# EAGLE design wificontrolpanel (EAGLE 8.2.1)
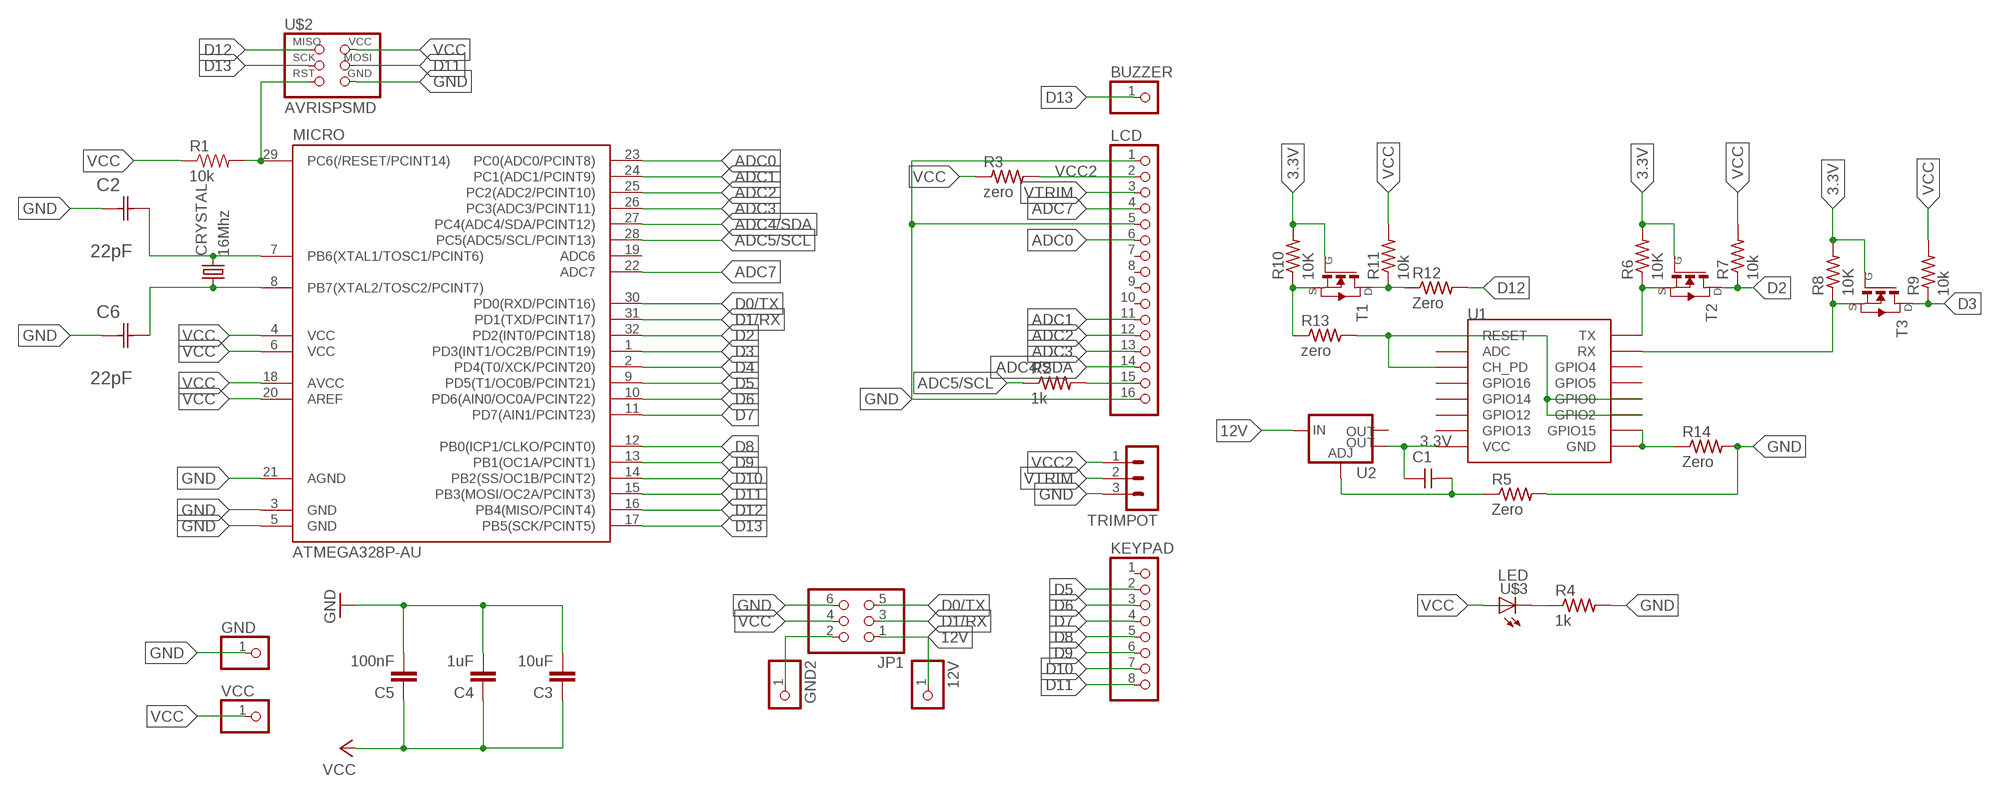
[diagram p0: schematic, sheet 1]

## Parts
12V  PINHD-1X1  [1X01]
BUZZER  PINHD-1X1  [1X01]
C1  CAP-UNPOLARIZEDFAB  [C1206FAB]
C2  22pF  0612ZC225MAT2A  [CAPC3216X178N]
C3  10uF  CAP1206  [1206]
C4  1uF  CAP1206  [1206]
C5  100nF  CAP1206  [1206]
C6  22pF  0612ZC225MAT2A  [CAPC3216X178N]
CRYSTAL  16Mhz  CSM-7X-DU  [CSM-7X-DU]
GND  PINHD-1X1  [1X01]
GND2  PINHD-1X1  [1X01]
JP1  PINHD-2X3-SMD  [2X03SMD]
KEYPAD  PINHD-1X8  [1X08]
LCD  PINHD-1X16  [1X16]
MICRO  ATMEGA328P-AU  ATMEGA48/88/168-AU  [TQFP32-08]
R1  10k  RESISTOR1206  [1206]
R2  1k  RES-US1206FAB  [R1206FAB]
R3  zero  RES-US1206FAB  [R1206FAB]
R4  1k  RES-US1206  [R1206]
R5  Zero  RES-US1206FAB  [R1206FAB]
R6  10K  RES-US1206FAB  [R1206FAB]
R7  10k  RES-US1206FAB  [R1206FAB]
R8  10K  RES-US1206FAB  [R1206FAB]
R9  10k  RES-US1206FAB  [R1206FAB]
R10  10K  RES-US1206FAB  [R1206FAB]
R11  10k  RES-US1206FAB  [R1206FAB]
R12  Zero  RES-US1206FAB  [R1206FAB]
R13  zero  RES-US1206FAB  [R1206FAB]
R14  Zero  RES-US1206FAB  [R1206FAB]
T1  NMOSFETSOT23  [SOT-23]
T2  NMOSFETSOT23  [SOT-23]
T3  NMOSFETSOT23  [SOT-23]
TRIMPOT  MA03-1  [MA03-1]
U1  ESP12SMD  [ESP12-SMD]
U2  V_REG_LM1117SOT223  [SOT223]
U$2  AVRISPSMD  [2X03SMD]
U$3  LED  [LED1206]
VCC  PINHD-1X1  [1X01]

## Nets
3.3V: C1.1 R6.2 R8.2 R10.2 T1.3(G) T2.3(G) T3.3(G) U1.VCC U2.4(OUT)
12V: 12V.1 JP1.1 U2.3(IN)
ADC0: LCD.6 MICRO.23(PC0(ADC0/PCINT8))
ADC1: LCD.11 MICRO.24(PC1(ADC1/PCINT9))
ADC2: LCD.12 MICRO.25(PC2(ADC2/PCINT10))
ADC3: LCD.13 MICRO.26(PC3(ADC3/PCINT11))
ADC4/SDA: LCD.14 MICRO.27(PC4(ADC4/SDA/PCINT12))
ADC5/SCL: MICRO.28(PC5(ADC5/SCL/PCINT13)) R2.1
ADC7: LCD.4 MICRO.22(ADC7)
D0/TX: JP1.5 MICRO.30(PD0(RXD/PCINT16))
D1/RX: JP1.3 MICRO.31(PD1(TXD/PCINT17))
D2: MICRO.32(PD2(INT0/PCINT18)) R7.1 T2.1(D)
D3: MICRO.1(PD3(INT1/OC2B/PCINT19)) R9.1 T3.1(D)
D4: MICRO.2(PD4(T0/XCK/PCINT20))
D5: KEYPAD.2 MICRO.9(PD5(T1/OC0B/PCINT21))
D6: KEYPAD.3 MICRO.10(PD6(AIN0/OC0A/PCINT22))
D7: KEYPAD.4 MICRO.11(PD7(AIN1/PCINT23))
D8: KEYPAD.5 MICRO.12(PB0(ICP1/CLKO/PCINT0))
D9: KEYPAD.6 MICRO.13(PB1(OC1A/PCINT1))
D10: KEYPAD.7 MICRO.14(PB2(SS/OC1B/PCINT2))
D11: KEYPAD.8 MICRO.15(PB3(MOSI/OC2A/PCINT3)) U$2.4(MOSI)
D12: MICRO.16(PB4(MISO/PCINT4)) R12.2 U$2.1(MISO)
D13: BUZZER.1 MICRO.17(PB5(SCK/PCINT5)) U$2.3(SCK)
GND: C2.1(C1) C3.2 C4.2 C5.2 C6.1(C1) GND.1 JP1.6 LCD.1 LCD.5 LCD.16 MICRO.3(GND) MICRO.5(GND) MICRO.21(AGND) R4.2 R5.2 R14.2 TRIMPOT.3 U$2.6(GND)
GND2: GND2.1 JP1.2
GND3: C1.2 R5.1 U2.1(ADJ)
GND4: R14.1 U1.GND U1.GPIO15
N$3: MICRO.29(PC6(/RESET/PCINT14)) R1.2 U$2.5(RST)
N$4: C2.2(C2) CRYSTAL.2 MICRO.7(PB6(XTAL1/TOSC1/PCINT6))
N$5: R6.1 T2.2(S) U1.TXD0(TX)
N$6: LCD.15 R2.2
N$7: R4.1 U$3.2(C)
N$8: R8.1 T3.2(S) U1.RXD0(RX)
N$9: R10.1 R13.1 T1.2(S)
N$10: R13.2 U1.CH_PD U1.GPIO0 U1.GPIO2 U1.RESET
N$11: R11.1 R12.1 T1.1(D)
N$12: C6.2(C2) CRYSTAL.1 MICRO.8(PB7(XTAL2/TOSC2/PCINT7))
VCC: C3.1 C4.1 C5.1 JP1.4 MICRO.4(VCC) MICRO.6(VCC) MICRO.18(AVCC) MICRO.20(AREF) R1.1 R3.1 R7.2 R9.2 R11.2 U$2.2(VCC) U$3.1(A) VCC.1
VCC2: LCD.2 R3.2 TRIMPOT.1
VTRIM: LCD.3 TRIMPOT.2
Unconnected: KEYPAD.1 LCD.7 LCD.8 LCD.9 LCD.10 MICRO.19(ADC6) U1.ADC U1.GPIO4 U1.GPIO5 U1.GPIO12 U1.GPIO13 U1.GPIO14 U1.GPIO16 U2.2(OUT)

## Library data of the parts
12V BUZZER GND GND2 VCC = pinhead:PINHD-1X1: PIN HEADER
C1 = fab:CAP-UNPOLARIZED
C2 C6 = AVX_By_element14_Batch_1:0612ZC225MAT2A: Capacitor 1206; MPN: 0612ZC225MAT2A; OC_FARNELL: -; OC_NEWARK: 12N3209; SUPPLIER: AVX; TOLERANCE: ±20%; VALUE: 2.2µF; VOLTAGERATING: 10V
C3-C5 = 01_SparkFun:CAP: Capacitor Standard 0603 ceramic capacitor, and 0.1" leaded capacitor.
CRYSTAL = 01_FAB_Hello:CSM-7X-DU: SMD CRYSTAL Source: www.ecsxtal.com .. Crystal 3.6864MHz CSM_7X_DU.PDF; OC_FARNELL: unknown; OC_NEWARK: unknown
JP1 = fab:PINHD-2X3-SMD: PIN HEADER
KEYPAD = pinhead:PINHD-1X8: PIN HEADER
LCD = pinhead:PINHD-1X16: PIN HEADER
MICRO = atmega8:ATMEGA48/88/168
R1 = 01_SparkFun:RESISTOR: Resistor Basic schematic elements and footprints for 0603, 1206, and PTH 1/10th watt (small) resistors.
R2-R14 = fab:RES-US: Resistor (US Symbol) Variants with postfix FAB are widened to allow the routing of internal traces
T1-T3 = fab:NMOSFET: MOS FET
TRIMPOT = con-lstb:MA03-1: PIN HEADER; OC_FARNELL: unknown; OC_NEWARK: unknown
U1 = esp8266modules:ESP12: ESP8266 Wifi module 12
U2 = fab:V_REG_LM1117: Voltage Regulator LM1117 Standard adjustable voltage regulator but in SMD form. Spark Fun Electronics SKU : COM-00595; PROD_ID: VREG-08170
U$2 = fab:AVRISP
U$3 = fab:LED: LED

## Board
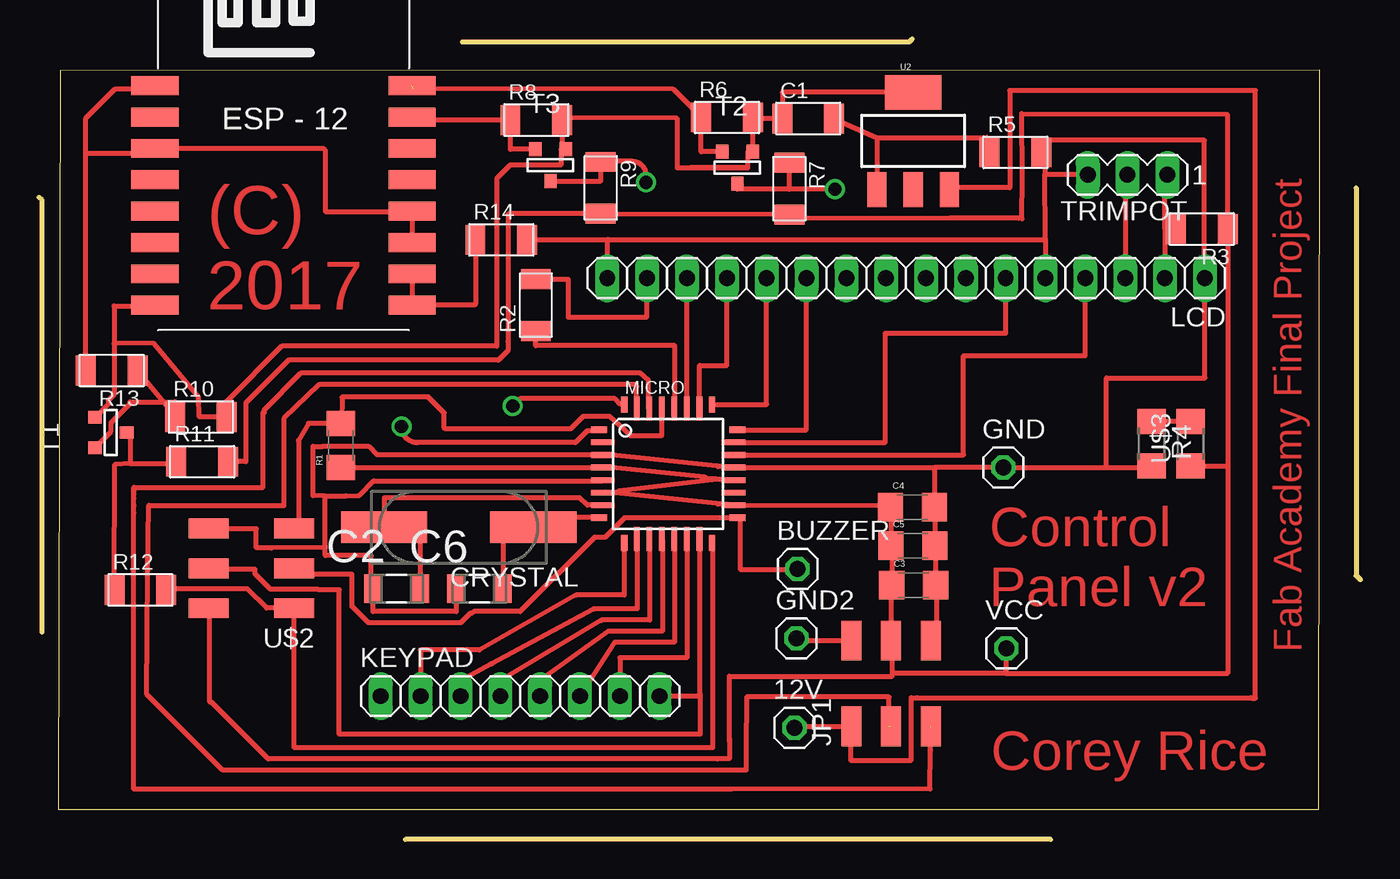
[diagram p1: board, top side]
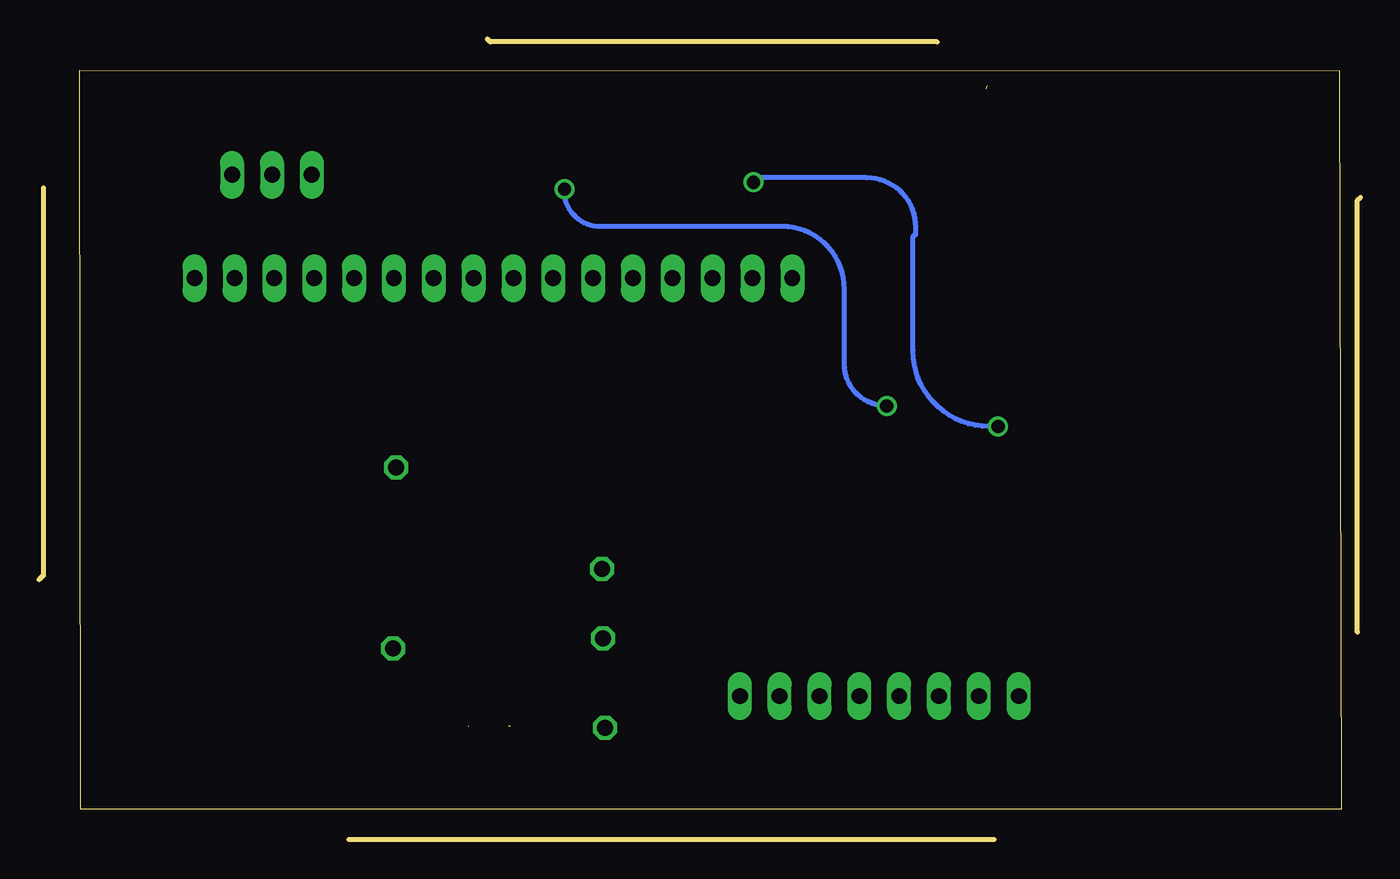
[diagram p2: board, bottom side, seen from below]

Size 84.23 x 51.03 mm. Coordinates in mm from the lower left corner, seen from the top.
Outline: 26.98,50.85 55.48,50.85 55.65,51.03
Outline: 83.96,41.55 83.96,16.83 84.23,16.57
Outline: 64.5,0 23.36,0
Outline: 0.18,13.2 0.18,40.75 0,40.93
Outline: 1.21,1.91 81.58,1.91 81.64,49.03 1.35,49.03 1.21,1.91
Copper layers (1*16): Top 0.035mm / dielectric 1.5mm / Bottom 0.035mm
Design rules "default *": minimum track width 12mil, minimum drill 24mil, track to track 16mil, track to pad 16mil, pad to pad 16mil, via to via 16mil, smd to smd 16mil, copper to edge 40mil, drill to drill 8mil, minimum pad ring 10mil, minimum via ring 8mil, stop-mask expansion 4mil, vias tented up to drill 0mil, thermal gap 10mil

### Footprints (pad centres in the part's own frame; a part is rotated, then mirrored left to right if it is on the bottom)
1X01 = drill 1.016 octagon: 1 0,0
C1206FAB = smd 1.27 x 1.905: 1 -1.651,0; 2 1.651,0
CAPC3216X178N = smd 1.118 x 1.803: 1 -1.499,0; 2 1.499,0
1206 = smd 1.6 x 1.8: 1 -1.4,0; 2 1.4,0
CSM-7X-DU = smd 5.5 x 2: 1 -4.75,0; 2 4.75,0
2X03SMD = smd 2.54 x 1.27: 1 -2.54,2.54; 2 2.92,2.54; 3 -2.54,0; 4 2.92,0; 5 -2.54,-2.54; 6 2.92,-2.54
1X08 = drill 1.016 long: 1 -8.89,0; 2 -6.35,0; 3 -3.81,0; 4 -1.27,0; 5 1.27,0; 6 3.81,0; 7 6.35,0; 8 8.89,0
1X16 = drill 1.016 long: 1 -19.05,0; 2 -16.51,0; 3 -13.97,0; 4 -11.43,0; 5 -8.89,0; 6 -6.35,0; 7 -3.81,0; 8 -1.27,0; 9 1.27,0; 10 3.81,0; 11 6.35,0; 12 8.89,0; 13 11.43,0; 14 13.97,0; 15 16.51,0; 16 19.05,0
TQFP32-08 = smd 1.016 x 0.406: 1 -4.42,2.8; 8 -4.42,-2.8; 17 4.42,-2.8; 24 4.42,2.8 | smd 1.524 x 0.356: 2 -4.166,2; 3 -4.166,1.2; 4 -4.166,0.4; 5 -4.166,-0.4; 6 -4.166,-1.2; 7 -4.166,-2; 18 4.166,-2; 19 4.166,-1.2; 20 4.166,-0.4; 21 4.166,0.4; 22 4.166,1.2; 23 4.166,2 | smd 0.406 x 1.016: 9 -2.8,-4.42; 16 2.8,-4.42; 25 2.8,4.42; 32 -2.8,4.42 | smd 0.356 x 1.524: 10 -2,-4.166; 11 -1.2,-4.166; 12 -0.4,-4.166; 13 0.4,-4.166; 14 1.2,-4.166; 15 2,-4.166; 26 2,4.166; 27 1.2,4.166; 28 0.4,4.166; 29 -0.4,4.166; 30 -1.2,4.166; 31 -2,4.166
R1206FAB = smd 1.27 x 1.905: 1 -1.651,0; 2 1.651,0
R1206 = smd 1.6 x 1.803: 1 -1.422,0; 2 1.422,0
SOT-23 = smd 0.787 x 0.889: 1 0.025,-1.016; 2 -0.94,1.016; 3 0.991,1.016
MA03-1 = drill 1.016 long: 1 -2.54,0; 2 0,0; 3 2.54,0
ESP12-SMD = smd 3 x 1.2: ADC -8.3,3.8; CH_PD -8.3,1.8; GND 8.1,-8.2; GPIO0 8.1,-2.2; GPIO2 8.1,-4.2; GPIO4 8.1,1.8; GPIO5 8.1,-0.2; GPIO12 -8.3,-4.2; GPIO13 -8.3,-6.2; GPIO14 -8.3,-2.2; GPIO15 8.1,-6.2; GPIO16 -8.3,-0.2; RESET -8.3,5.8; RXD0 8.1,3.8; TXD0 8.1,5.8; VCC -8.3,-8.2
SOT223 = smd 1.219 x 2.235: 1 -2.311,-3.099; 2 0,-3.099; 3 2.311,-3.099 | smd 3.6 x 2.2: 4 0,3.099
LED1206 = smd 1.6 x 1.803: 1 -1.422,0; 2 1.422,0

### Placement (x,y rotation side)
12V  48.15,7.11 0 top
BUZZER  48.36,17.24 0 top
C1  49.03,45.97 0 top
C2  22.79,15.99 0 top
C3  55.75,16.22 0 top
C4  55.67,21.19 0 top
C5  55.71,18.73 0 top
C6  28.07,15.99 0 top
CRYSTAL  26.74,19.9 180 top
GND  61.46,23.71 0 top
GND2  48.28,12.8 0 top
JP1  54.32,9.75 90 top
KEYPAD  30.67,9.14 0 top
LCD  55.27,35.78 180 top
MICRO  40.1,23.31 0 top
R1  19.23,25.12 90 top
R2  31.66,34.07 90 top
R3  74.12,38.92 180 top
R4  70.91,25.22 270 top
R5  62.24,43.81 0 top
R6  43.85,46.03 0 top
R7  47.82,41.49 270 top
R8  31.69,45.87 0 top
R9  35.8,41.55 270 top
R10  10.31,26.94 0 top
R11  10.39,24.08 0 top
R12  6.46,15.91 0 top
R13  4.62,29.9 180 top
R14  29.46,38.23 0 top
T1  4.57,25.92 90 top
T2  44.49,42.83 0 top
T3  32.57,42.99 0 top
TRIMPOT  69.39,42.37 180 top
U1  15.68,42.26 0 top
U2  55.72,44.53 0 top
U$2  13.72,17.28 180 top
U$3  73.42,25.23 90 top
VCC  61.66,12.18 0 top

### Tracks (layer width: path | path; a pad name or v marks a point on that pad's centre or on a via)
3.3V
  Top 0.305: T3.3 | T3.3 33.34,44.01 R8.2 33.34,46.01 40.66,45.98 40.67,42.83 45.18,42.83 | R6.2 45.48,46.03 45.48,45.97 | 45.48,45.97 T2.3 45.18,43.85 45.18,42.83 | 41.51,42.81 41.55,42.84 45.18,42.83 | T3.3 33.26,44.01 33.27,43.01 30.04,43.01 29.17,42.15 29.17,31.45 15.47,31.45 11.98,27.96 12.11,27.76 11.88,27.68 11.9,27.11 12.1,27.07 R10.2 10.2,26.94 10.16,28.2 7.34,31.62 4.83,31.64 | 4.83,31.64 4.78,31.59 4.78,28.35 4.41,27.99 4.41,27.76 T1.3 | 4.83,31.64 4.83,33.93 4.75,34.01 7.32,34.01 U1.VCC | U2.4 47.38,47.63 C1.1 45.48,45.97
12V
  Top 0.305: 12V.1 48.15,7.21 JP1.1 51.73,7.21 51.73,5.05 55.61,5.05 55.61,9.03 55.98,9.03 55.99,9.04 77.27,9.04 77.3,9 77.55,9 77.55,47.75 61.87,47.75 61.87,41.56 58.03,41.56 U2.3
ADC0
  Top 0.305: LCD.6 61.62,32.28 53.94,32.28 53.94,25.31 MICRO.23
ADC1
  Top 0.305: MICRO.24 48.92,26.11 LCD.11
ADC2
  Top 0.305: MICRO.25 46.38,27.73 LCD.12
ADC3
  Top 0.305: MICRO.26 42.11,30.23 43.84,30.23 LCD.13
ADC4/SDA
  Top 0.305: MICRO.27 LCD.14
ADC5/SCL
  Top 0.305: MICRO.28 40.53,27.48 40.53,31.48 31.66,31.48 R2.1
ADC7
  Top 0.305: LCD.4 66.7,30.84 58.94,30.84 58.94,24.51 MICRO.22
D0/TX  (1 unrouted)
  Top 0.305: MICRO.30 38.84,27.54 38.84,29.3 38.29,29.76 16.74,29.76 16.67,29.73 14.35,27.39 14.35,27.21 14.27,27.21 14.27,22.45 6.04,22.45 6.04,22.21 | 56.83,7.18 56.83,5.68 56.79,3.22 44.17,3.2 6.04,3.2 6.04,20.83 6.03,21.3 6.03,21.27 6.03,21.75 6.04,22.21 | 6.04,22.01 6.04,22.21
D1/RX  (1 unrouted)
  Top 0.305: MICRO.31 38.1,28.9 38,29 17.84,29 15.59,26.83 15.59,21.29 6.99,21.3 | 6.99,21.3 | 54.19,7.21 54.19,9.08 45.1,9.09 45.07,5.74 45.07,4.41 11.71,4.41 6.87,9.26 6.91,17.09 6.92,17.16 6.99,21.3
D2  (via drill 0.85)
  Top 0.305: MICRO.32 37.08,27.73 36.7,28.11 30.67,28.11 v30.19,27.63 | v50.73,41.46 47.82,41.46 | 47.82,41.46 R7.1 | 47.82,41.46 44.52,41.46 T2.1
  Bottom 0.305: v30.19,27.63 30.21,27.63 arc90 32.9,30.32 32.9,35.12 arc-90 36.85,39.08 48.47,39.08 arc90 50.77,41.38 50.77,41.43 arc90 v50.73,41.46
D3  (via drill 0.85)
  Top 0.305: T3.1 35.8,41.98 R9.1 arc-90 35.83,43.23 37.82,43.23 arc-90 38.69,42.37 v38.69,41.9 | MICRO.1 35.62,26.05 34.94,26.05 34.19,25.3 24.12,25.3 arc-90 v23.09,26.33
  Bottom 0.305: v23.09,26.33 23.67,26.33 arc90 28.52,31.18 28.52,38.37 arc90 28.34,38.56 28.34,39.05 arc-90 31.47,42.19 38.4,42.19 arc-90 v38.69,41.9
D5
  Top 0.305: MICRO.9 37.3,15.58 34.23,15.58 28.06,12.07 24.31,12.07 KEYPAD.2
D6
  Top 0.305: MICRO.10 38.12,19.13 38.12,14.7 35.34,14.7 | 35.34,14.7 35.34,14.67 | 35.34,14.7 28.89,11.22 28.85,11.22 28.81,11.18 26.9,10.15 KEYPAD.3
D7
  Top 0.305: MICRO.11 38.93,19.12 38.93,13.99 35.84,13.99 | 35.84,13.99 35.84,13.95 | 35.84,13.99 29.42,10.15 KEYPAD.4
D8
  Top 0.305: MICRO.12 39.73,19.11 39.73,13.28 36.27,13.28 | 36.27,13.28 36.27,13.27 | 36.27,13.28 31.95,10.18 KEYPAD.5
D9
  Top 0.305: MICRO.13 40.49,12.57 36.69,12.57 KEYPAD.6
D10
  Top 0.305: MICRO.14 41.29,11.59 37.02,11.59 KEYPAD.7
D11
  Top 0.305: MICRO.15 42.13,19.15 42.13,9.27 | 42.13,9.27 42.13,6.7 19.13,6.7 19.13,15.91 17.79,15.91 17.76,15.94 14.75,15.94 13.76,16.93 13.76,17.23 10.8,17.23 U$2.4 | KEYPAD.8 42.13,9.14 42.13,9.27
D12
  Top 0.305: R12.2 8.18,15.98 13.27,15.98 14.5,14.74 U$2.1 16.26,5.84 42.93,5.84 42.93,18.89 MICRO.16
D13
  Top 0.305: BUZZER.1 48.36,17.23 44.68,17.23 44.68,20.51 MICRO.17 37.34,20.51 36.09,19.26 35.39,19.26 30.66,14.53 27.7,14.53 27.59,14.42 27.48,14.42 26.88,13.81 20.99,13.81 19.95,14.85 19.95,16.91 16.26,16.91 U$2.3 15.74,17.28 15.69,17.33
GND
  Top 0.305: MICRO.21 | 18.24,18.69 18.24,18.6 14.8,18.58 13.83,18.59 13.83,19.81 10.81,19.81 U$2.6 | 18.24,18.69 18.24,21.89 | 18.24,21.89 19.56,21.91 20.42,21.93 21.34,22.87 35.87,22.85 MICRO.5 | 18.24,21.89 17.46,21.91 17.46,25.06 18.08,25.06 18.1,25.08 20.99,25.08 21.54,24.53 35.93,24.53 | MICRO.3 35.93,24.53 | MICRO.21 43.66,23.78 43.27,23.78 43.23,23.82 36.49,24.53 35.93,24.53 | MICRO.21 57.07,23.7 | 57.07,23.7 C4.2 57.11,21.19 C5.2 57.15,18.73 C3.2 57.21,16.22 57.21,12.25 56.86,12.25 JP1.6 | 61.59,23.7 57.07,23.7 | 64.16,43.93 64.13,42.44 | 64.16,43.93 64.17,44.58 74.29,44.58 74.27,35.78 LCD.1 74.32,29.42 68.05,29.42 68.05,23.7 | 64.15,38.3 64.13,42.44 | 64.15,38.3 LCD.5 | TRIMPOT.3 64.13,42.37 64.13,42.44 | GND.1 61.59,23.71 61.59,23.7 | 61.59,23.7 68.05,23.7 | 68.05,23.7 70.91,23.7 R4.2 | 36.22,38.21 LCD.16 | 36.22,38.21 36.26,38.25 64.09,38.25 64.15,38.3 | R14.2 36.19,38.23 36.22,38.21 | R5.2 64.13,43.9 64.16,43.93 | C6.1 26.58,14.52 21.29,14.52 C2.1 21.16,15.99 21.16,18.09 18.24,18.09 18.24,18.69
GND2
  Top 0.305: JP1.2 48.28,12.67 GND2.1
GND3
  Top 0.305: R5.1 60.4,43.81 60.4,44.76 53.41,44.74 | 53.41,44.74 U2.1 | C1.2 50.67,45.97 53.41,44.74
GND4
  Top 0.305: R14.1 27.81,34.13 27.76,34.08 23.8,34.08 U1.GND U1.GPIO15
N$3
  Top 0.305: R1.2 19.29,26.61 19.3,28.19 19.32,28.21 24.81,28.21 25.82,27.2 25.82,26.24 25.89,26.17 33.89,26.17 34.69,26.97 36.35,26.97 37.69,25.75 39.66,25.75 39.69,25.78 MICRO.29 | 16.3,19.82 U$2.5 16.54,20.11 16.54,25.42 16.54,25.44 17.17,26.52 R1.2 | 19.23,26.54 R1.2
N$4
  Top 0.305: MICRO.7 34.93,21.31 34.46,21.78 21.99,21.78 CRYSTAL.2 24.28,19.9 C2.2
N$5  (1 unrouted)
  Top 0.305: T2.2 42.2,43.85 R6.1 42.2,46.08 40.44,47.83 40.42,47.83 23.84,47.86
N$6
  Top 0.305: LCD.15 38.72,35.78 38.72,33.29 33.73,33.29 33.73,35.7 31.66,35.7 R2.2
N$7
  Top 0.305: U$3.2 R4.1
N$8
  Top 0.305: T3.2 30.04,44.01 R8.1 23.84,45.87 U1.RXD0
N$9
  Top 0.305: T1.2 4.58,26.01 4.58,26.57 5.8,27.79 5.8,27.9 8.66,27.9 R10.1 8.73,26.94 R13.1
N$10
  Top 0.305: U1.RESET 7.44,47.86 4.85,47.86 2.97,45.98 2.97,43.77 | 7.49,43.95 U1.CH_PD | R13.2 2.97,43.77 | 2.97,43.77 7.08,43.77 U1.CH_PD | U1.CH_PD 18.13,44.06 18.24,43.94 18.24,40.03 23.75,40.03 U1.GPIO0 U1.GPIO2
N$11
  Top 0.305: R12.1 4.79,15.91 4.82,23.89 5.81,23.96 | 5.81,23.96 8.74,23.96 R11.1 | T1.1 5.81,25.95 5.81,23.96
N$12
  Top 0.305: MICRO.8 31.49,20.51 CRYSTAL.1 29.57,19.9 C6.2
VCC
  Top 0.305: MICRO.18 | 44.26,21.28 MICRO.18 | MICRO.20 43.65,22.98 43.22,22.98 | 43.22,22.98 42.56,22.98 42.44,23.1 36.49,23.71 MICRO.4 R1.1 | 36.15,22.14 MICRO.6 | 43.22,22.98 36.99,22.24 36.93,22.18 36.61,22.14 36.15,22.14 | MICRO.18 43.64,21.38 43.27,21.38 43.23,21.42 36.15,22.14 | MICRO.18 54.27,21.3 C4.1 54.31,21.19 C5.1 54.35,18.73 C3.1 54.32,16.22 JP1.4 54.4,12.67 54.4,10.59 | 54.4,10.59 54.4,10.4 44,10.4 44,6.44 44,6.27 44,6.45 | U$2.2 10.88,14.74 10.88,8.77 10.96,8.77 14.6,5.13 43.23,5.13 44,5.14 44,6.45 | 61.76,10.59 54.4,10.59 | 61.76,10.59 75.77,10.59 75.77,23.81 | 75.77,23.81 R3.1 75.74,38.95 75.74,46.23 62.65,46.28 62.67,42.18 62.66,39.58 62.45,39.6 58.06,39.63 47.95,39.6 R7.2 36.25,39.87 R9.2 | VCC.1 61.64,10.58 61.76,10.59 | U$3.1 75.77,23.81 | 36.25,39.9 R9.2 | R9.2 29.93,39.9 29.89,39.85 29.89,31.74 | 29.89,31.74 | 29.89,31.74 29.89,31.16 29.28,30.55 15.9,30.55 13.17,27.83 13.17,24.08 R11.2 | 44,6.45
VCC2
  Top 0.305: TRIMPOT.1 71.78,42.37 71.78,38.92 | 71.78,38.92 LCD.2 | R3.2 71.78,38.92
VTRIM
  Top 0.305: TRIMPOT.2 69.24,42.37 LCD.3

### Text on the board
Top: (C) / 2017 | Control / Panel v2 | Fab Academy Final Project | Corey Rice